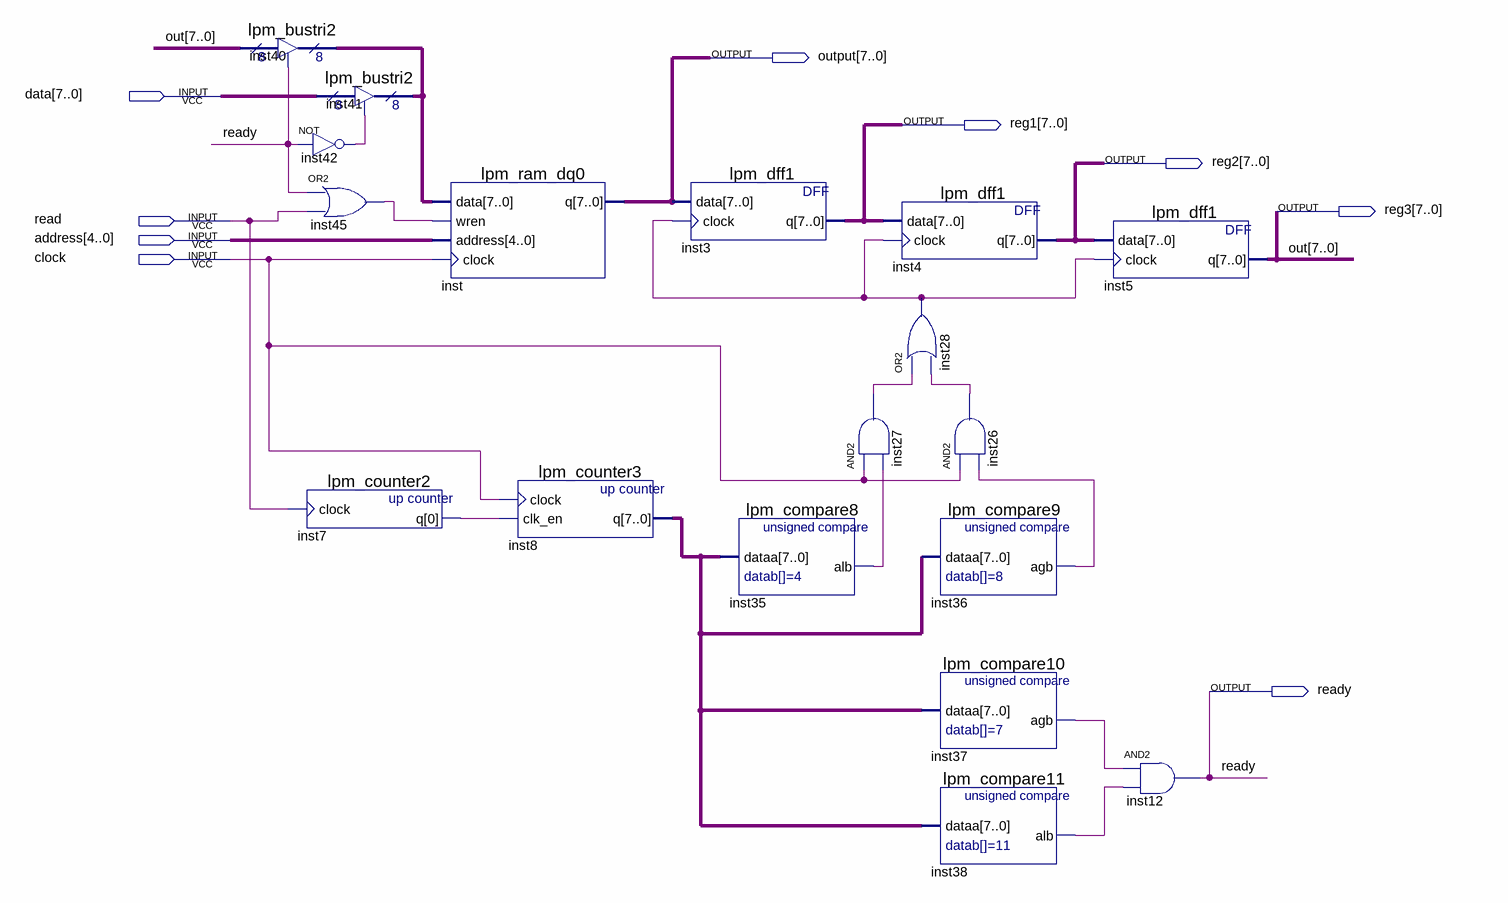
[diagram p0: schematic sheet]
// Quartus schematic ramBlock.bdf as structural Verilog: 18 symbols, 9 pins
module ramBlock (
  input  [7:0] data,
  input  read,
  input  [4:0] address,
  input  clock,
  output [7:0] \output ,
  output [7:0] reg1,
  output [7:0] reg2,
  output [7:0] reg3,
  output ready
);

  wire inst7_q, inst26_out, inst27_out, inst28_out, inst35_alb, inst36_agb, inst37_agb, inst38_alb,
       inst42_out, inst45_out;
  wire [7:0] inst8_q, inst40_tridata;

  lpm_bustri2 inst40 (.enabledt(ready), .data(reg3), .tridata(inst40_tridata));
  not inst42 (inst42_out, ready);
  lpm_counter2 inst7 (.clock(read), .q(inst7_q));
  lpm_bustri2 inst41 (.enabledt(inst42_out), .data(data), .tridata(inst40_tridata));
  or inst45 (inst45_out, ready, read);
  lpm_ram_dq0 inst (.data(inst40_tridata), .wren(inst45_out), .address(address), .clock(clock), .q(\output ));
  lpm_counter3 inst8 (.clock(clock), .clk_en(inst7_q), .q(inst8_q));
  lpm_dff1 inst3 (.data(\output ), .clock(inst28_out), .q(reg1));
  lpm_compare8 inst35 (.dataa(inst8_q), .alb(inst35_alb));
  lpm_dff1 inst4 (.data(reg1), .clock(inst28_out), .q(reg2));
  or inst28 (inst28_out, inst27_out, inst26_out);
  and inst27 (inst27_out, clock, inst35_alb);
  and inst26 (inst26_out, clock, inst36_agb);
  lpm_compare9 inst36 (.dataa(inst8_q), .agb(inst36_agb));
  lpm_compare10 inst37 (.dataa(inst8_q), .agb(inst37_agb));
  lpm_compare11 inst38 (.dataa(inst8_q), .alb(inst38_alb));
  lpm_dff1 inst5 (.data(reg2), .clock(inst28_out), .q(reg3));
  and inst12 (ready, inst37_agb, inst38_alb);

  // Other names for the same wires on the sheet: out[7:0] = reg3
endmodule
